# EAGLE design master (EAGLE 5.11)
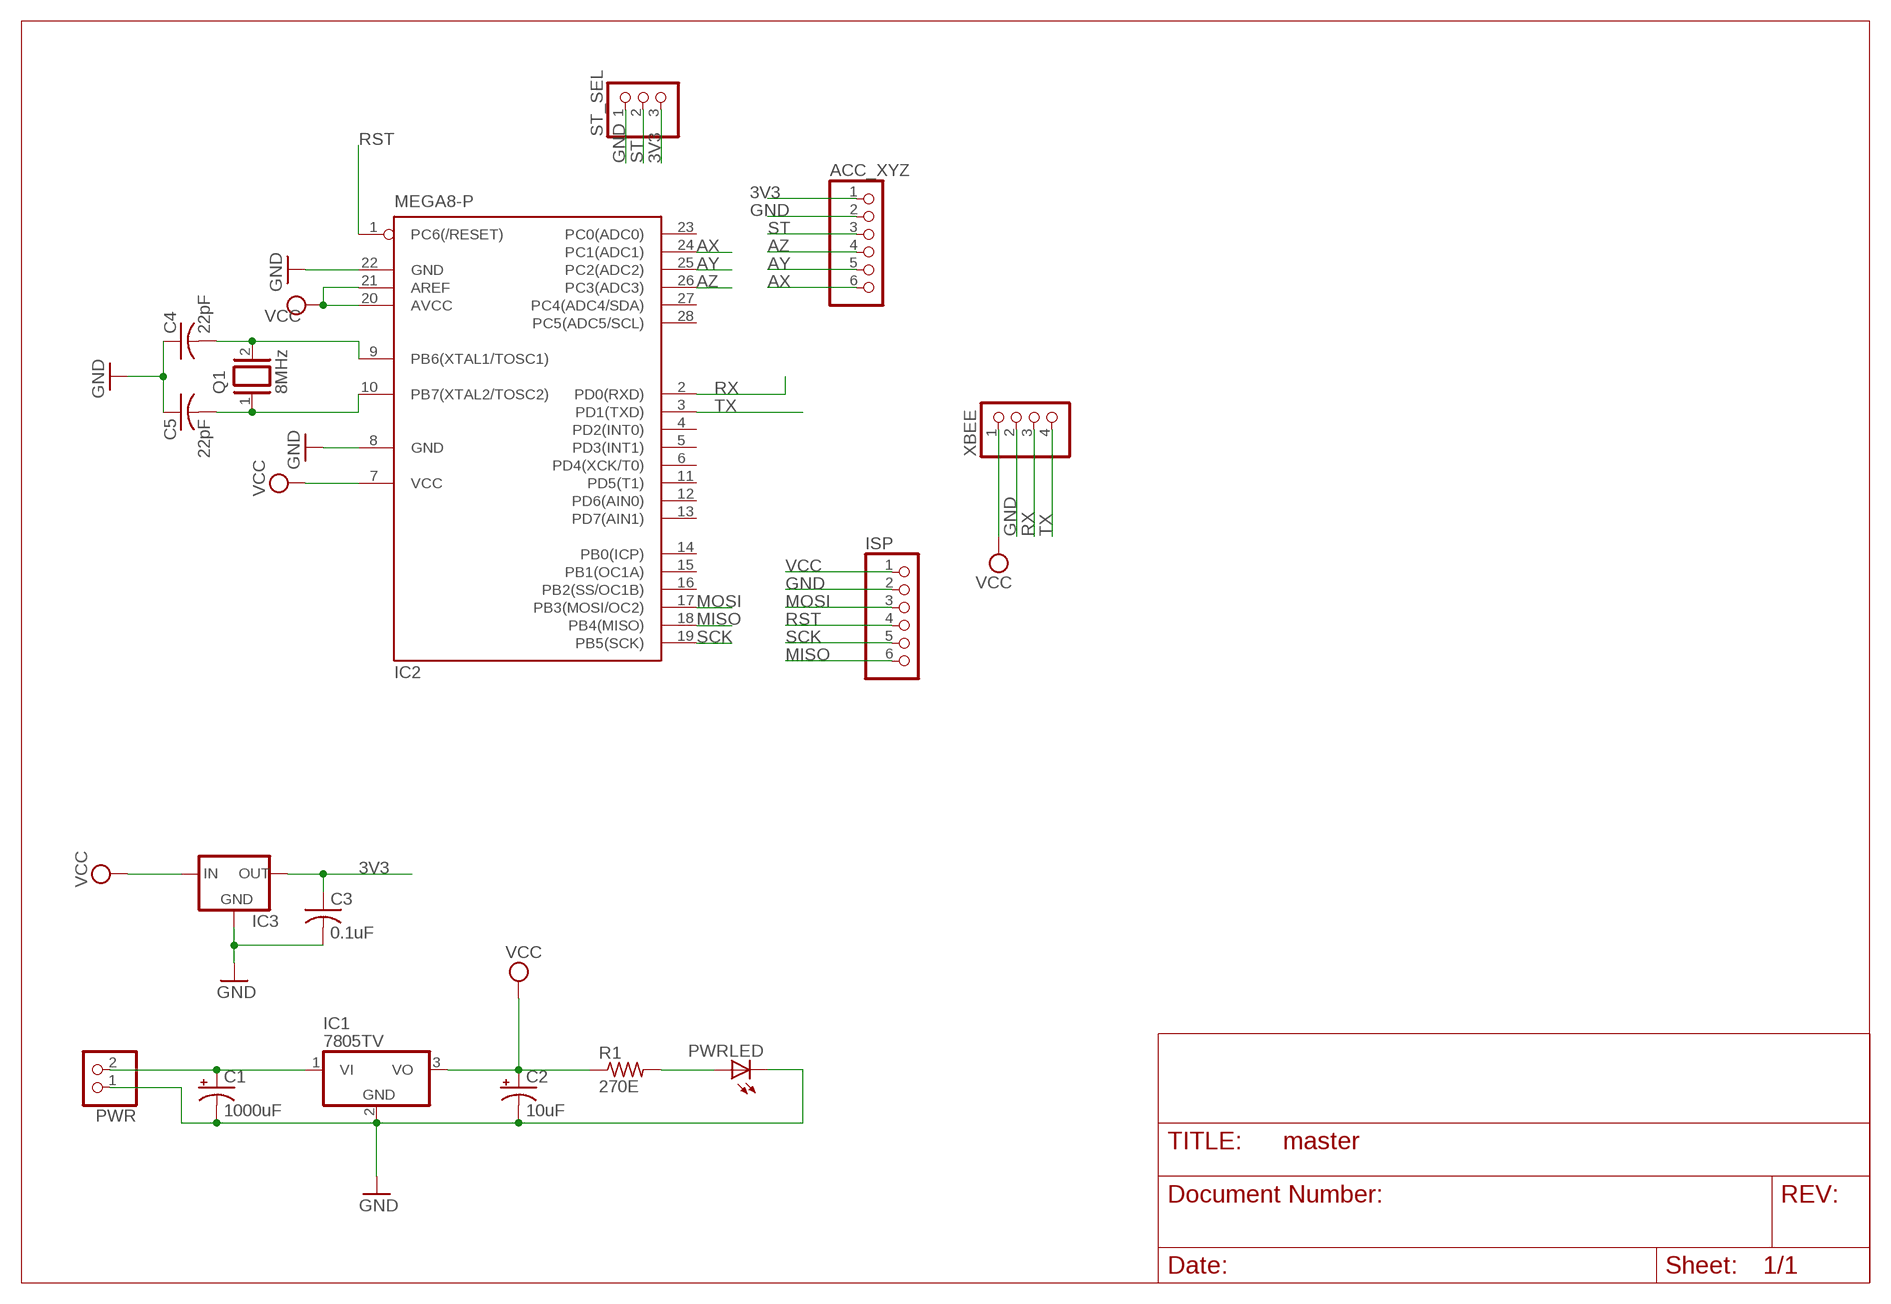
[diagram p0: schematic, sheet 1]

## Parts
ACC_XYZ  PINHD-1X6  [1X06]
C1  1000uF  CPOL-USE3.5-10  [E3,5-10]
C2  10uF  CPOL-USE2.5-6  [E2,5-6]
C3  0.1uF  C-US025-024X044  [C025-024X044]
C4  22pF  C-US025-024X044  [C025-024X044]
C5  22pF  C-US025-024X044  [C025-024X044]
IC1  7805TV  [TO220V]
IC2  MEGA8-P  [DIL28-3]
IC3  LM1117  [SOT223]
ISP  PINHD-1X6  [1X06]
PWR  PINHD-1X2  [1X02]
PWRLED  LED5MM  [LED5MM]
Q1  8MHz  XTAL/S  [QS]
R1  270E  R-US_0207/7  [0207/7]
ST_SEL  PINHD-1X3  [1X03]
XBEE  PINHD-1X4  [1X04]

## Nets
3V3: ACC_XYZ.1 C3.1 IC3.2(OUT) ST_SEL.3
AX: ACC_XYZ.6 IC2.24(PC1(ADC1))
AY: ACC_XYZ.5 IC2.25(PC2(ADC2))
AZ: ACC_XYZ.4 IC2.26(PC3(ADC3))
GND: ACC_XYZ.2 C1.- C2.- C3.2 C4.1 C5.1 IC1.2(GND) IC2.8(GND) IC2.22(GND) IC3.1(GND) ISP.2 PWR.1 PWRLED.K(C) ST_SEL.1 XBEE.2
MISO: IC2.18(PB4(MISO)) ISP.6
MOSI: IC2.17(PB3(MOSI/OC2)) ISP.3
N$1: C1.+ IC1.1(VI) PWR.2
N$2: C4.2 IC2.9(PB6(XTAL1/TOSC1)) Q1.2
N$3: C5.2 IC2.10(PB7(XTAL2/TOSC2)) Q1.1
N$4: PWRLED.A R1.2
RST: IC2.1(PC6(/RESET)) ISP.4
RX: IC2.2(PD0(RXD)) XBEE.3
SCK: IC2.19(PB5(SCK)) ISP.5
ST: ACC_XYZ.3 ST_SEL.2
TX: IC2.3(PD1(TXD)) XBEE.4
VCC: C2.+ IC1.3(VO) IC2.7(VCC) IC2.20(AVCC) IC2.21(AREF) IC3.3(IN) ISP.1 R1.1 XBEE.1
Unconnected: IC2.4(PD2(INT0)) IC2.5(PD3(INT1)) IC2.6(PD4(XCK/T0)) IC2.11(PD5(T1)) IC2.12(PD6(AIN0)) IC2.13(PD7(AIN1)) IC2.14(PB0(ICP)) IC2.15(PB1(OC1A)) IC2.16(PB2(SS/OC1B)) IC2.23(PC0(ADC0)) IC2.27(PC4(ADC4/SDA)) IC2.28(PC5(ADC5/SCL))

## Library data of the parts
ACC_XYZ ISP = pinhead:PINHD-1X6: PIN HEADER
C1 C2 = resistor:CPOL-US: POLARIZED CAPACITOR, American symbol
C3-C5 = rcl:C-US: CAPACITOR, American symbol
IC1 = linear:78*: Positive VOLTAGE REGULATOR Source: http://cache.national.com/ds/LM/LM78L05.pdf http://www.fairchildsemi.com/ds/LM/LM7805.pdf
IC2 = atmel:MEGA8-P: MICROCONTROLLER 8 Kbytes FLASH, 1 kbytes SRAM, 512 bytes EEPROM, USART, 4-channel 10 bit ADC, 2-channel 8 bit ADC Pin compatible with Atmega48, ATMega88, ATMega168 Source: avr.lbr; OC_FARNELL: unknown; OC_NEWARK: unknown
IC3 = v-reg-2:LM1117
PWR = pinhead:PINHD-1X2: PIN HEADER
PWRLED = led:LED: LED OSRAM: - CHIPLED LG R971, LG N971, LY N971, LG Q971, LY Q971, LO R971, LY R971 LH N974, LH R974 LS Q976, LO Q976, LY Q976 LO Q996 - Hyper CHIPLED LW Q18S LB Q993, LB Q99A, LB R99A - SideLED LS A670, LO A670, LY A670, LG A670, LP A670 LB A673, LV A673, LT A673, LW A673 LH A674 LY A675 LS A676, LA A676, LO A676, LY A676, LW A676 LS A679, LY A679, LG A679 - Hyper Micro SIDELED® LS Y876, LA Y876, LO Y876, LY Y876 LT Y87S - SmartLED LW L88C, LW L88S LB L89C, LB L89S, LG L890 LS L89K, LO L89K, LY L89K LS L896, LA L896, LO L896, LY L896 - TOPLED LS T670, LO T670, LY T670, LG T670, LP T670 LSG T670, LSP T670, LSY T670, LOP T670, LYG T670 LG T671, LOG T671, LSG T671 LB T673, LV T673, LT T673, LW T673 LH T674 LS T676, LA T676, LO T676, LY T676, LB T676, LH T676, LSB T676, LW T676 LB T67C, LV T67C, LT T67C, LS T67K, LO T67K, LY T67K, LW E67C LS E67B, LA E67B, LO E67B, LY E67B, LB E67C, LV E67C, LT E67C LW T67C LS T679, LY T679, LG T679 LS T770, LO T770, LY T770, LG T770, LP T770 LB T773, LV T773, LT T773, LW T773 LH T774 LS E675, LA E675, LY E675, LS T675 LS T776, LA T776, LO T776, LY T776, LB T776 LHGB T686 LT T68C, LB T68C - Hyper Mini TOPLED® LB M676 - Mini TOPLED Santana® LG M470 LS M47K, LO M47K, LY M47K Source: http://www.osram.convergy.de LUXEON: - LUMILED® LXK2-PW12-R00, LXK2-PW12-S00, LXK2-PW14-U00, LXK2-PW14-V00 LXK2-PM12-R00, LXK2-PM12-S00, LXK2-PM14-U00 LXK2-PE12-Q00, LXK2-PE12-R00, LXK2-PE12-S00, LXK2-PE14-T00, LXK2-PE14-U00 LXK2-PB12-K00, LXK2-PB12-L00, LXK2-PB12-M00, LXK2-PB14-N00, LXK2-PB14-P00, LXK2-PB14-Q00 LXK2-PR12-L00, LXK2-PR12-M00, LXK2-PR14-Q00, LXK2-PR14-R00 LXK2-PD12-Q00, LXK2-PD12-R00, LXK2-PD12-S00 LXK2-PH12-R00, LXK2-PH12-S00 LXK2-PL12-P00, LXK2-PL12-Q00, LXK2-PL12-R00 Source: www.luxeon.com KINGBRIGHT: KA-3528ASYC Source: www.kingbright.com
Q1 = special:XTAL/S: CRYSTAL
R1 = resistor:R-US_: RESISTOR, American symbol
ST_SEL = pinhead:PINHD-1X3: PIN HEADER
XBEE = pinhead:PINHD-1X4: PIN HEADER

## Board
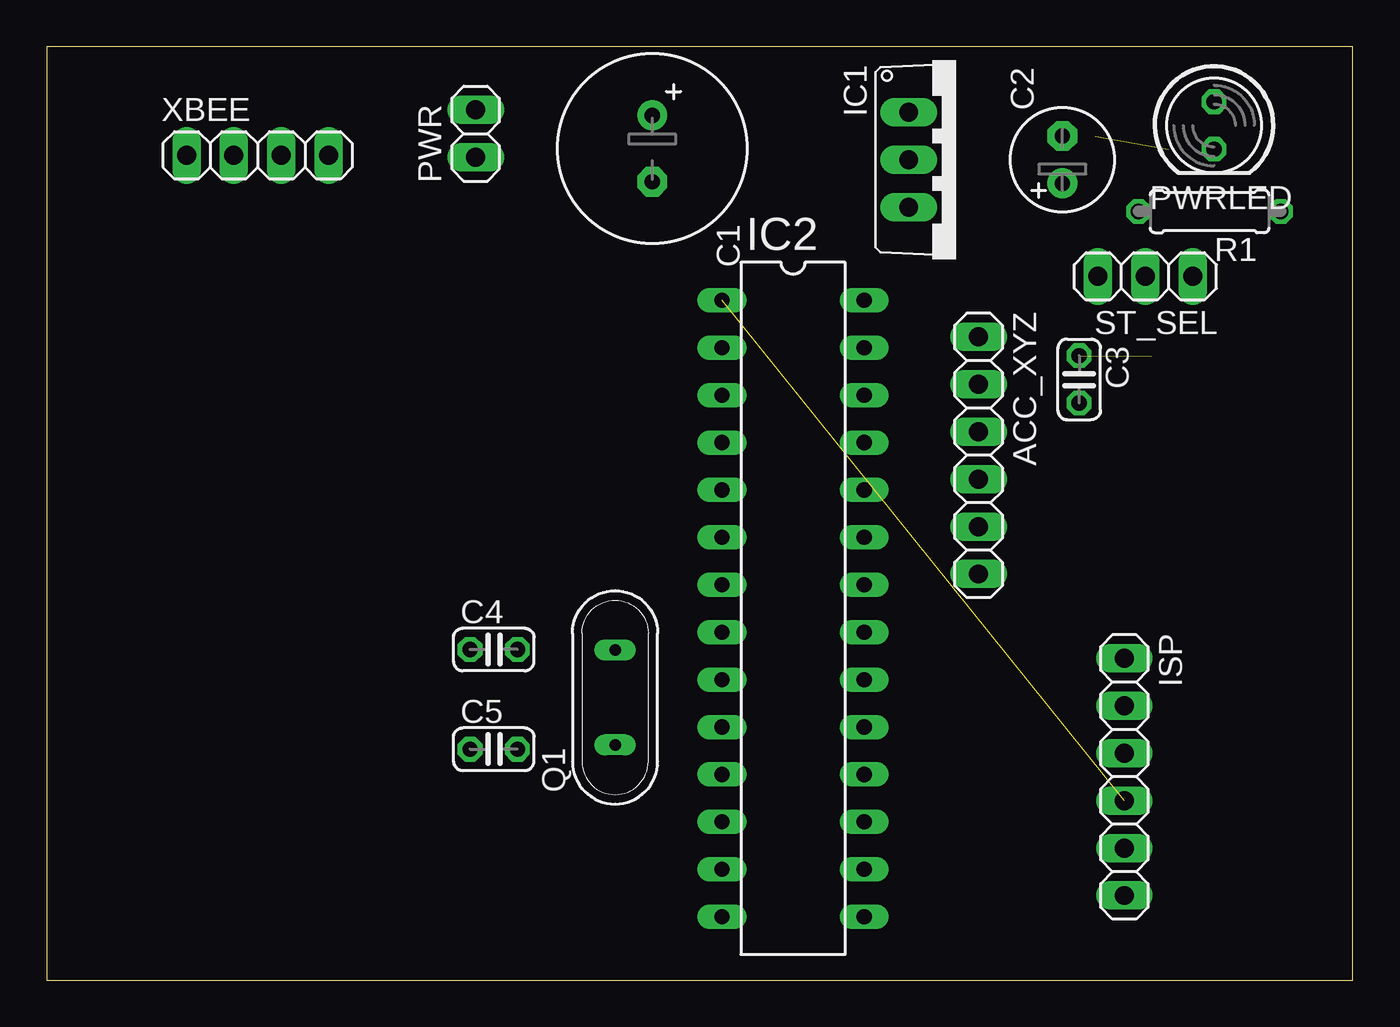
[diagram p1: board, top side]
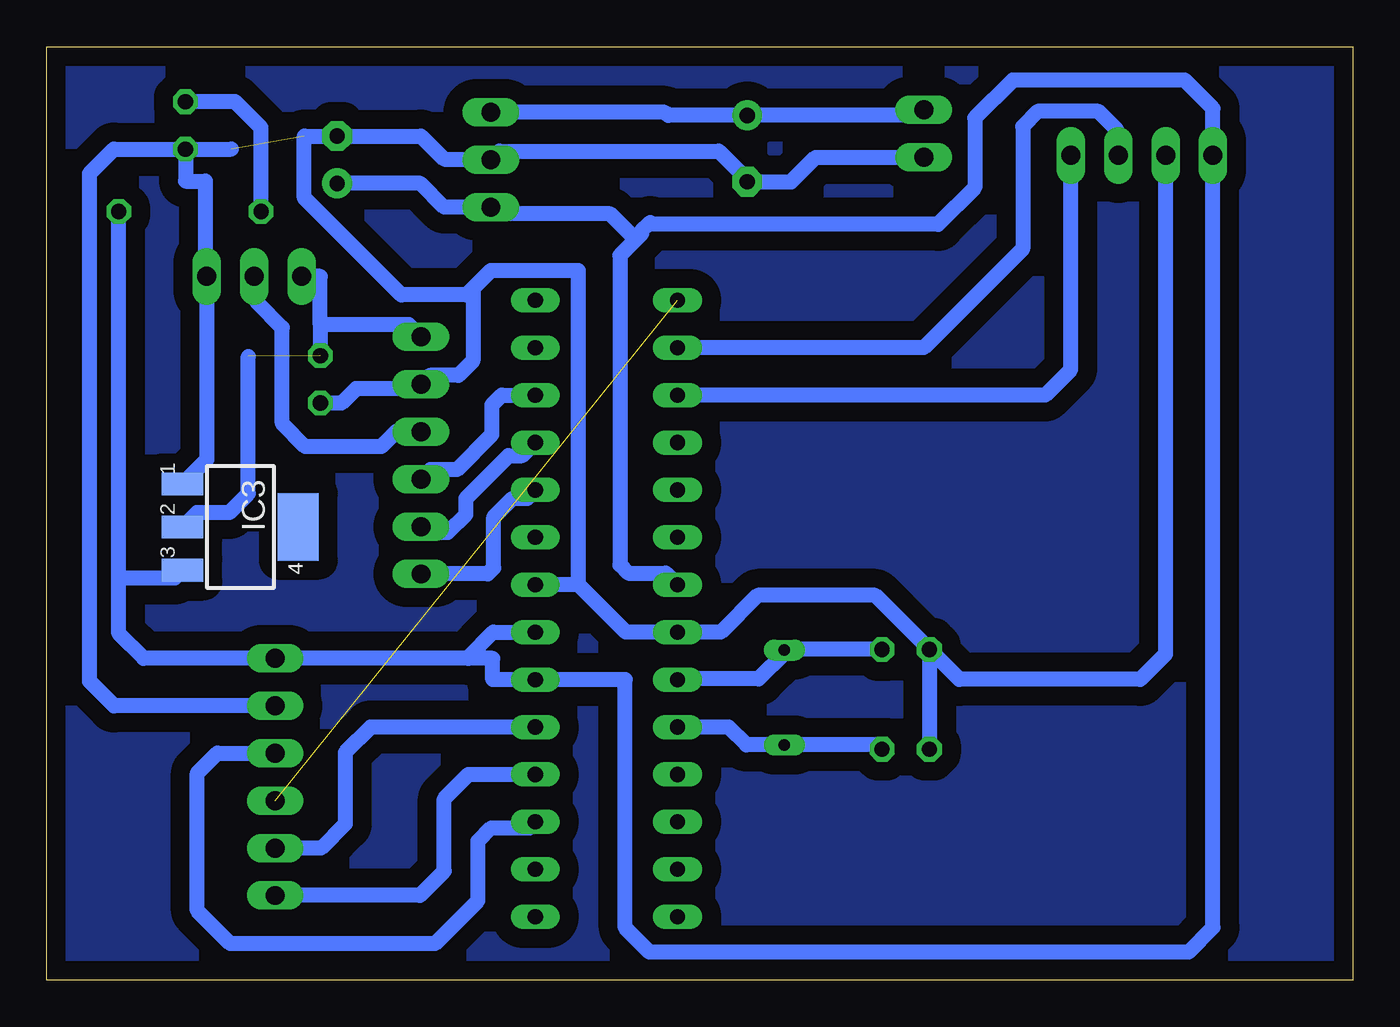
[diagram p2: board, bottom side, seen from below]

Size 70 x 50 mm. Coordinates in mm from the lower left corner, seen from the top.
Outline: 0,0 70,0 70,50 0,50 0,0
Copper layers (1*16): Top 0.035mm / dielectric 1.5mm / Bottom 0.035mm
Design rules "master *": minimum track width 0.8mm, minimum drill 1mm, track to track 0.5mm, track to pad 8mil, pad to pad 8mil, via to via 8mil, smd to smd 8mil, copper to edge 40mil, drill to drill 8mil, minimum pad ring 10mil, minimum via ring 8mil, stop-mask expansion 4mil, vias tented up to drill 0mil, thermal gap 10mil

### Footprints (pad centres in the part's own frame; a part is rotated, then mirrored left to right if it is on the bottom)
1X06 = drill 1.016 long: 1 -6.35,0; 2 -3.81,0; 3 -1.27,0; 4 1.27,0; 5 3.81,0; 6 6.35,0
E3,5-10 = drill 0.813 pad 1.6 round: + -1.778,0 | drill 0.813 pad 1.6 octagon: - 1.778,0
E2,5-6 = drill 0.813 pad 1.6 round: + -1.27,0 | drill 0.813 pad 1.6 octagon: - 1.27,0
C025-024X044 = drill 0.813 octagon: 1 -1.27,0; 2 1.27,0
TO220V = drill 1.016 long: 1 -2.54,-2.54; 2 0,-2.54; 3 2.54,-2.54
DIL28-3 = drill 0.813 long: 1 -16.51,-3.81; 2 -13.97,-3.81; 3 -11.43,-3.81; 4 -8.89,-3.81; 5 -6.35,-3.81; 6 -3.81,-3.81; 7 -1.27,-3.81; 8 1.27,-3.81; 9 3.81,-3.81; 10 6.35,-3.81; 11 8.89,-3.81; 12 11.43,-3.81; 13 13.97,-3.81; 14 16.51,-3.81; 15 16.51,3.81; 16 13.97,3.81; 17 11.43,3.81; 18 8.89,3.81; 19 6.35,3.81; 20 3.81,3.81; 21 1.27,3.81; 22 -1.27,3.81; 23 -3.81,3.81; 24 -6.35,3.81; 25 -8.89,3.81; 26 -11.43,3.81; 27 -13.97,3.81; 28 -16.51,3.81
SOT223 = smd 1.219 x 2.235: 1 -2.311,-3.099; 2 0,-3.099; 3 2.311,-3.099 | smd 3.6 x 2.2: 4 0,3.099
1X02 = drill 1.016 long: 1 -1.27,0; 2 1.27,0
LED5MM = drill 0.813 octagon: A -1.27,0; K 1.27,0
QS = drill 0.61 long: 1 -2.54,0; 2 2.54,0
0207/7 = drill 0.813 octagon: 1 -3.81,0; 2 3.81,0
1X03 = drill 1.016 long: 1 -2.54,0; 2 0,0; 3 2.54,0
1X04 = drill 1.016 long: 1 -3.81,0; 2 -1.27,0; 3 1.27,0; 4 3.81,0

### Placement (x,y rotation side)
ACC_XYZ  49.94,28.1 270 top
C1  32.45,44.54 270 top
C2  54.43,43.94 90 top
C3  55.33,32.18 270 top
C4  23.96,17.71 0 top
C5  23.96,12.37 0 top
IC1  48.74,43.94 270 top
IC2  40,19.9 270 top
IC3  59.62,24.27 270 bottom
ISP  57.76,10.88 270 top
PWR  22.99,45.34 90 top
PWRLED  62.56,45.78 270 top
Q1  30.46,15.14 90 top
R1  62.32,41.17 180 top
ST_SEL  58.88,37.69 180 top
XBEE  11.3,44.18 0 top

### Tracks (layer width: path | path; a pad name or v marks a point on that pad's centre or on a via)
3V3  (1 unrouted)
  Bottom 0.8: 55.33,35.11 C3.1 | 55.33,35.11 55.33,37.69 ST_SEL.3 | ACC_XYZ.1 50.6,35.11 55.33,35.11 | IC3.2 61.94,25.04 60.21,25.04 59.19,26.06 59.19,33.4
AX
  Bottom 0.8: IC2.24 44.25,25.81 45.03,25.81 46.04,24.8 46.04,22.08 46.37,21.75 ACC_XYZ.6
AY
  Bottom 0.8: IC2.25 44.51,28.09 45.25,28.09 47.53,25.81 47.53,24.93 48.5,23.96 50.39,23.96 50.06,24.29 ACC_XYZ.5
AZ
  Bottom 0.8: ACC_XYZ.4 49.43,27.34 48.02,27.34 46.13,29.23 46.13,30.81 45.61,31.33 IC2.26
GND  (1 unrouted)
  Bottom 0.8: 47.15,37.05 46.2,38 41.5,38 41.5,21.17 | 47.15,37.05 47.5,36.7 51,36.7 56.2,41.9 56.2,45.21 C2.- 49.94,45.21 48.7,43.97 46.2,43.97 IC1.2 45.73,44.4 33.97,44.4 32.45,42.88 C1.- 30.1,42.76 28.79,44.07 PWR.1 | 41.5,21.17 38.96,18.63 IC2.8 33.87,18.63 31.9,20.6 25.59,20.6 C4.1 | PWRLED.K 66.4,44.51 67.7,43.21 67.7,16 66.39,14.69 ISP.2 | 41.5,21.17 IC2.22 | PWRLED.K 62.56,42.8 61.5,42.8 61.5,37.69 ST_SEL.1 61.42,27.88 IC3.1 | PWRLED.K 60.1,44.51 | C4.1 21.09,16.1 11.4,16.1 10.03,17.47 XBEE.2 | C4.1 C5.1 | 47.15,37.05 47.15,33.17 47.93,32.39 49.46,32.39 ACC_XYZ.2 50.16,31.69 53.42,31.69 54.2,30.91 C3.2
MISO
  Bottom 0.8: ISP.6 50,4.53 48.7,5.83 48.7,9.7 47.39,11.01 IC2.18
MOSI
  Bottom 0.8: IC2.17 44.13,8.15 46.18,8.15 46.89,7.45 46.89,4.25 49.19,1.95 60.16,1.95 61.93,3.72 61.93,11.08 60.86,12.15 ISP.3
N$1
  Bottom 0.8: PWR.2 22.99,46.32 C1.+ 36.7,46.32 36.86,46.48 IC1.1
N$2
  Bottom 0.8: IC2.9 36.15,16.13 31.85,16.13 30.46,17.52 Q1.2 30.44,17.71 C4.2
N$3
  Bottom 0.8: IC2.10 33.45,13.55 32.5,12.6 Q1.1 25.46,12.6 C5.2
N$4
  Bottom 0.8: PWRLED.A 59.9,47.05 58.51,45.66 R1.2
N$5
  pour Bottom (isolate 1.016): 0.27,0.27 0.35,0.35 69.45,0.35 69.45,49.37 69.36,49.45 0.53,49.45 0.27,49.19 0.27,0.44
RST  (1 unrouted)
RX
  Bottom 0.8: XBEE.3 12.65,44.26 12.65,45.55 13.63,46.53 16.9,46.53 17.69,45.73 17.69,39.17 23,33.87 IC2.2
SCK
  Bottom 0.8: ISP.5 55.3,7.07 54,8.37 54,12.2 52.65,13.55 IC2.19
ST
  Bottom 0.8: ST_SEL.2 58.7,37.52 58.7,36.28 57.38,34.95 57.38,29.82 56.14,28.58 52.07,28.58 51.28,29.37 ACC_XYZ.3
TX
  Bottom 0.8: XBEE.4 15.11,32.7 16.48,31.33 IC2.3
VCC
  Bottom 0.8: 47.4,17.23 ISP.1 64.8,17.23 66.13,18.56 66.13,21.54 | 47.4,17.23 47.4,17.3 46.07,18.63 IC2.21 | C2.+ 49.97,42.67 48.7,41.4 IC1.3 46.2,41.04 39.8,41.04 38.5,39.74 38.11,40.13 | 47.4,17.23 46.1,17.23 46.1,16.09 IC2.20 39,16.09 39,2.8 37.7,1.5 8.79,1.5 7.49,2.8 XBEE.1 7.49,46.7 9.01,48.21 18.23,48.21 20.26,46.18 20.26,42.45 22.23,40.48 37.76,40.48 | 66.13,21.54 R1.1 | IC3.3 63.13,21.54 66.13,21.54 | 37.76,40.48 38.11,40.13 | 37.76,40.48 37.65,40.59 | IC2.7 36.82,21.8 38.84,21.8 39.28,22.25 39.28,38.82 38.11,39.99 38.11,40.13